# EAGLE schematic CHIP SHIELD (EAGLE 7.6.0)
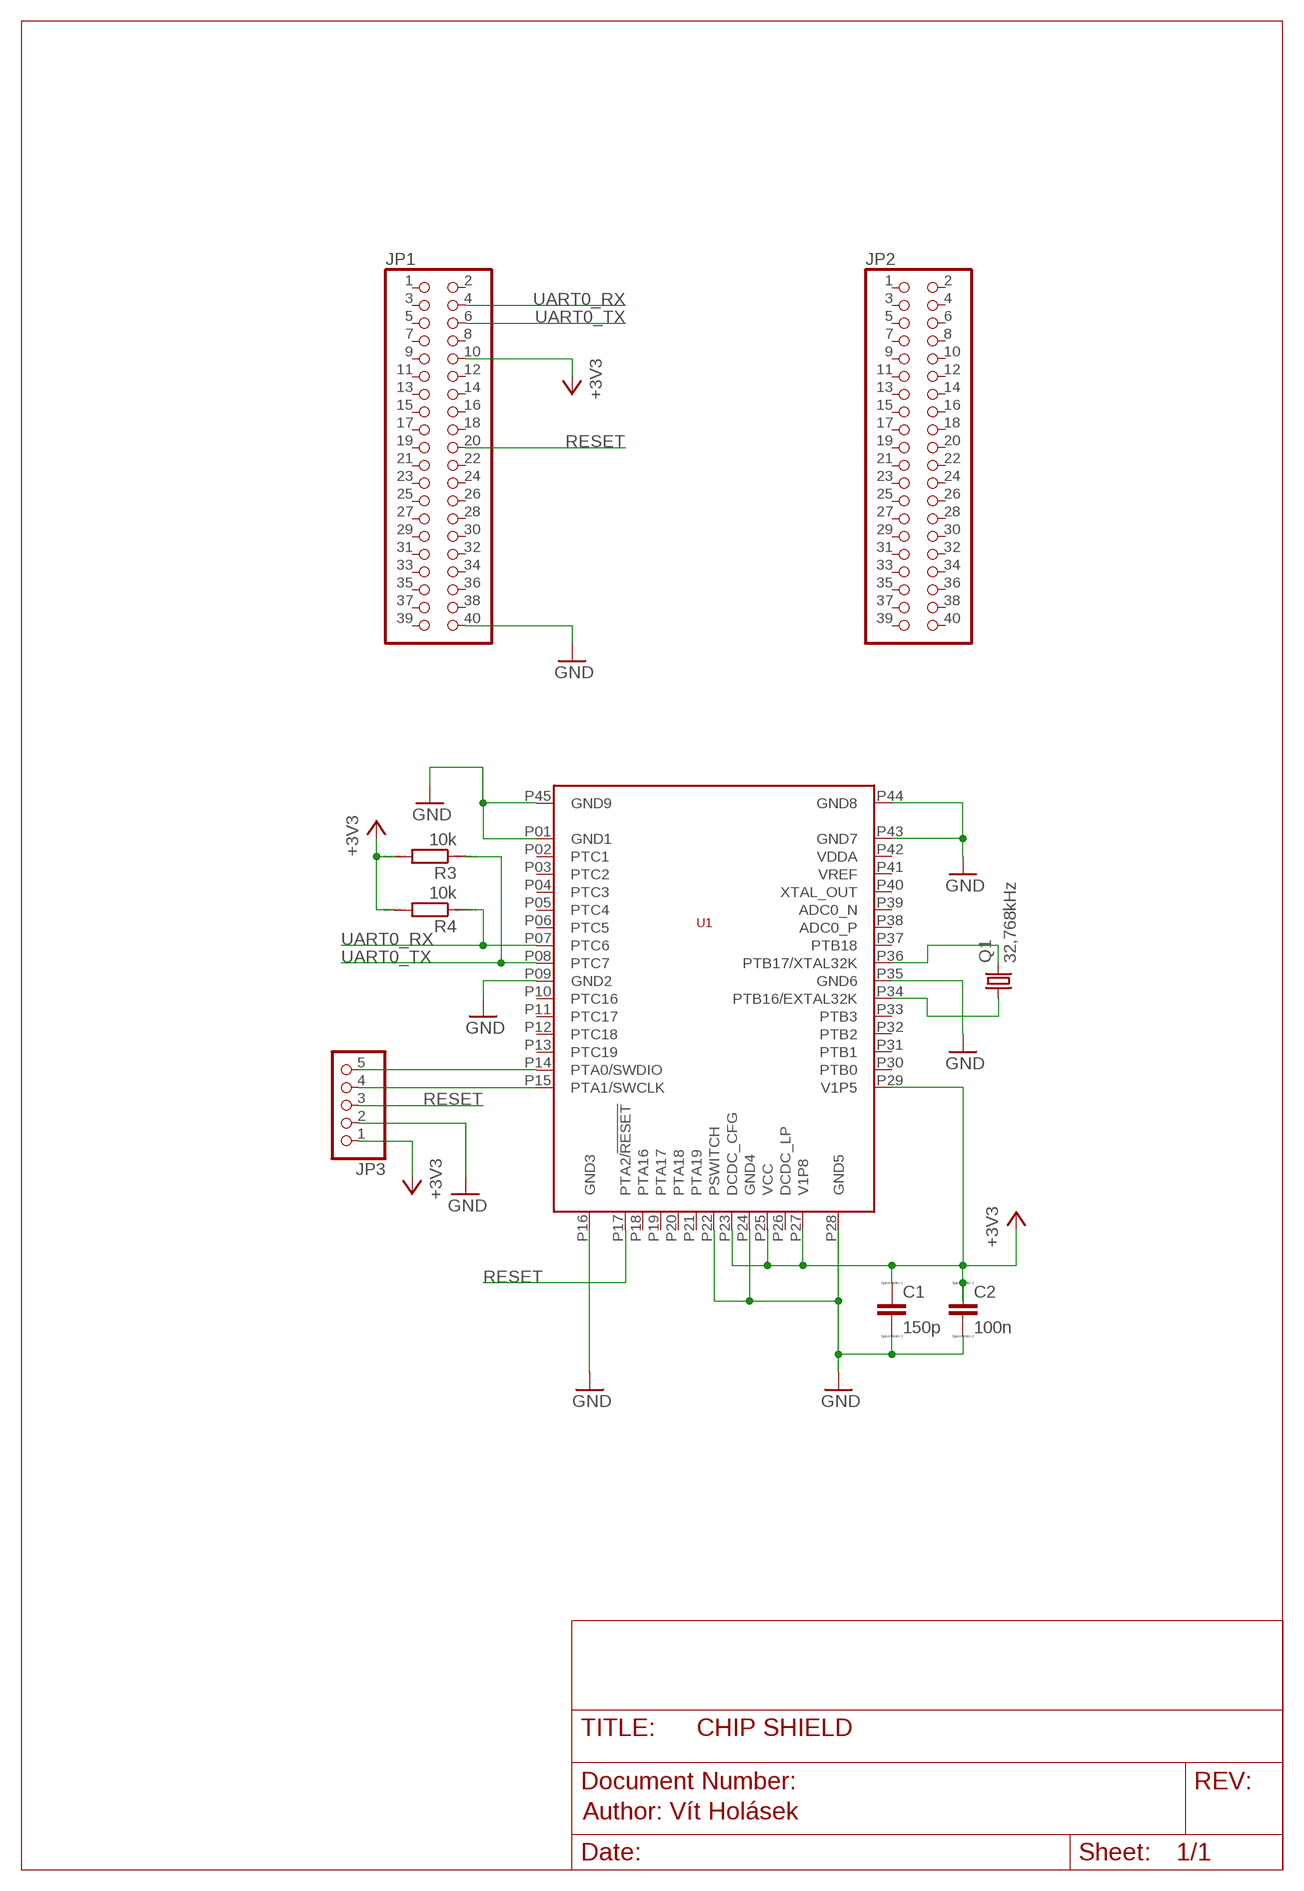
[diagram p0: schematic, sheet 1]

## Parts
C1  150p  CC0402  [C0402]
C2  100n  CC0402  [C0402]
JP1  PINHD-2X20  [2X20]
JP2  PINHD-2X20  [2X20]
JP3  PINHD-1X5  [1X05]
Q1  32,768kHz  MC-306  [MC-306]
R3  10k  RR0402  [R0402]
R4  10k  RR0402  [R0402]
U1  R41Z-T  [R41Z]

## Nets
+3V3: C1.1 C2.1 JP1.10 JP3.1 R3.2 R4.2 U1.P23(DCDC_CFG) U1.P25(VCC) U1.P27(V1P8) U1.P29(V1P5)
GND: C1.2 C2.2 JP1.40 JP3.2 U1.P01(GND1) U1.P09(GND2) U1.P16(GND3) U1.P22(PSWITCH) U1.P24(GND4) U1.P28(GND5) U1.P35(GND6) U1.P43(GND7) U1.P44(GND8) U1.P45(GND9)
N$1: Q1.1 U1.P34(PTB16/EXTAL32K)
N$2: Q1.4 U1.P36(PTB17/XTAL32K)
N$3: JP3.4 U1.P15(PTA1/SWCLK)
N$4: JP3.5 U1.P14(PTA0/SWDIO)
RESET: JP1.20 JP3.3 U1.P17(PTA2/!RESET!)
UART0_RX: JP1.4 R4.1 U1.P07(PTC6)
UART0_TX: JP1.6 R3.1 U1.P08(PTC7)
Unconnected: JP1.1 JP1.2 JP1.3 JP1.5 JP1.7 JP1.8 JP1.9 JP1.11 JP1.12 JP1.13 JP1.14 JP1.15 JP1.16 JP1.17 JP1.18 JP1.19 JP1.21 JP1.22 JP1.23 JP1.24 JP1.25 JP1.26 JP1.27 JP1.28 JP1.29 JP1.30 JP1.31 JP1.32 JP1.33 JP1.34 JP1.35 JP1.36 JP1.37 JP1.38 JP1.39 JP2.1 JP2.2 JP2.3 JP2.4 JP2.5 JP2.6 JP2.7 JP2.8 JP2.9 JP2.10 JP2.11 JP2.12 JP2.13 JP2.14 JP2.15 JP2.16 JP2.17 JP2.18 JP2.19 JP2.20 JP2.21 JP2.22 JP2.23 JP2.24 JP2.25 JP2.26 JP2.27 JP2.28 JP2.29 JP2.30 JP2.31 JP2.32 JP2.33 JP2.34 JP2.35 JP2.36 JP2.37 JP2.38 JP2.39 JP2.40 U1.P02(PTC1) U1.P03(PTC2) U1.P04(PTC3) U1.P05(PTC4) U1.P06(PTC5) U1.P10(PTC16) U1.P11(PTC17) U1.P12(PTC18) U1.P13(PTC19) U1.P18(PTA16) U1.P19(PTA17) U1.P20(PTA18) U1.P21(PTA19) U1.P26(DCDC_LP) U1.P30(PTB0) U1.P31(PTB1) U1.P32(PTB2) U1.P33(PTB3) U1.P37(PTB18) U1.P38(ADC0_P) U1.P39(ADC0_N) U1.P40(XTAL_OUT) U1.P41(VREF) U1.P42(VDDA)

## Notes on the sheet
- Author: Vít Holásek

## Library data of the parts
C1 C2 = tsc_common:C: CAPACITOR, European symbol; SPICEMODEL: NONE; SPICEPREFIX: C
JP1 JP2 = pinhead:PINHD-2X20: PIN HEADER
JP3 = pinhead:PINHD-1X5: PIN HEADER
Q1 = tsc_common:MC-306: kHz RANGE CRYSTAL UNIT SMD Source: MC-306_405_406_E07X.PDF Homepage <http://www.epsontoyocom.co.jp>; MPN: MC-306 60.0KHZ 100PPM ,12.5PF; OC_FARNELL: 1278040; OC_NEWARK: 31M5576
R3 R4 = tsc_common:R: RESISTOR, European symbol; SPICEMODEL: NONE; SPICEPREFIX: R
U1 = R41Z:R41Z